# Altium schematic sheet CODEC.SchDoc
size A4; SheetNumber: 2; SheetTotal: 5
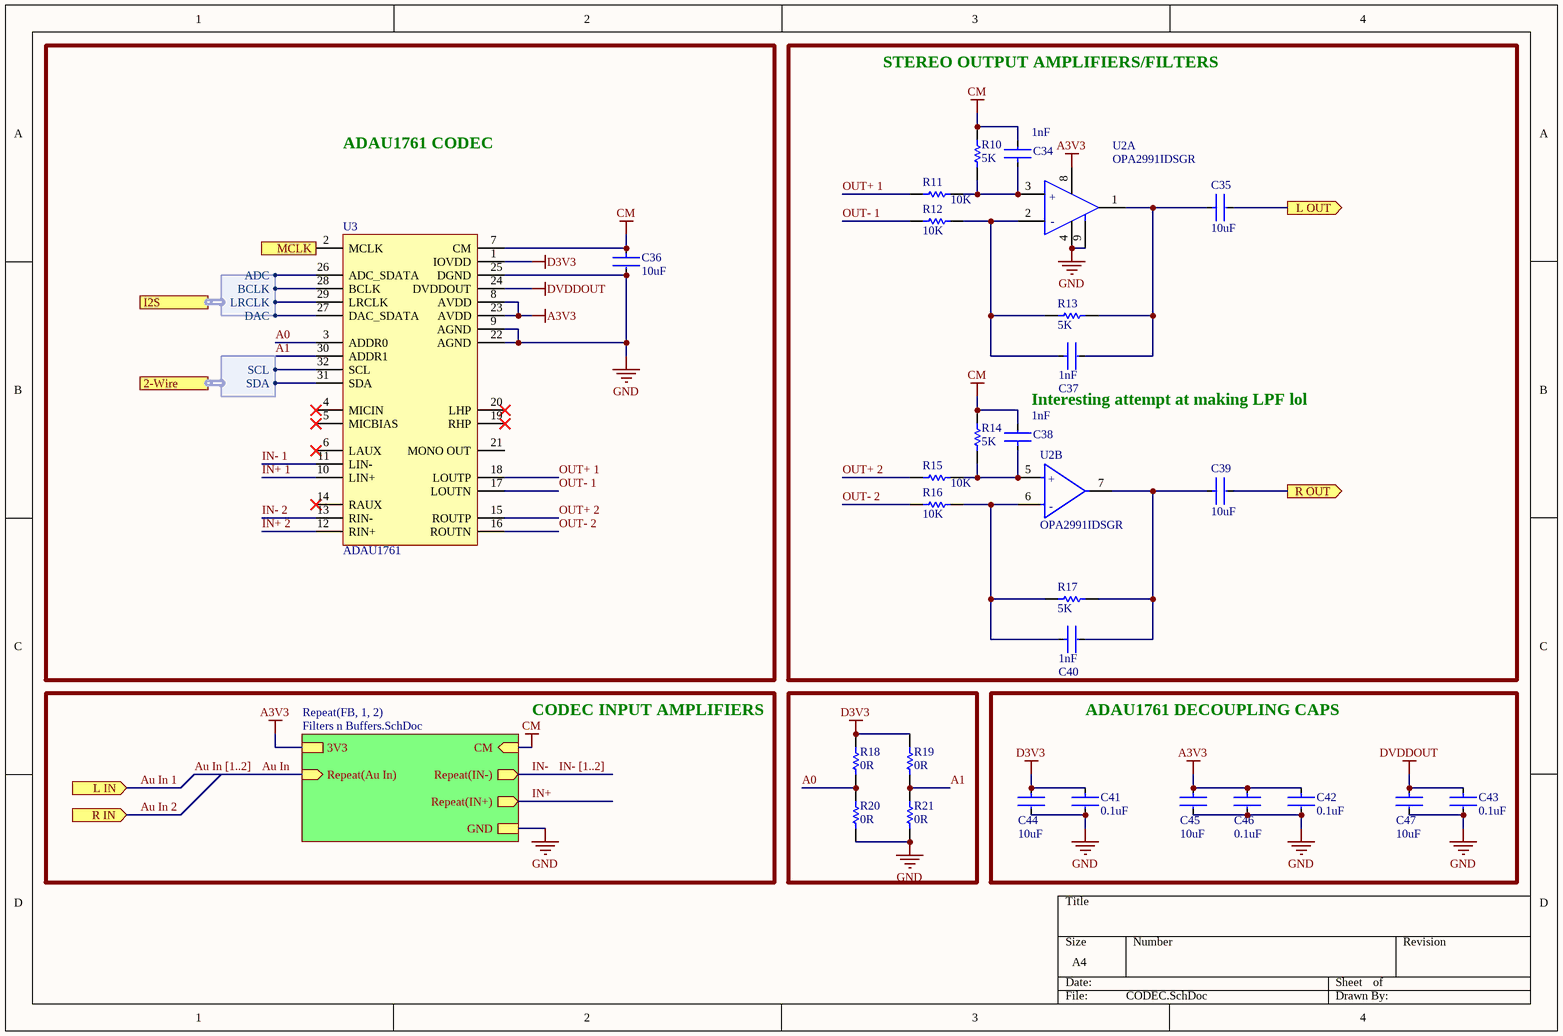
[diagram p0: CODEC.SchDoc]

## Parts
C34  1nF  [FP-GRM15-MFG]
C35  10uF  [FP-GRM15-MFG]
C36  10uF  [FP-GRM15-MFG]
C37  1nF  [FP-GRM15-MFG]
C38  1nF  [FP-GRM15-MFG]
C39  10uF  [FP-GRM15-MFG]
C40  1nF  [FP-GRM15-MFG]
C41  0.1uF  [FP-GRM15-MFG]
C42  0.1uF  [FP-GRM15-MFG]
C43  0.1uF  [FP-GRM15-MFG]
C44  10uF  [FP-GRM15-MFG]
C45  10uF  [FP-GRM15-MFG]
C46  0.1uF  [FP-GRM15-MFG]
C47  10uF  [FP-GRM15-MFG]
R10  5K  [RESC1005X40X25LL05T05]
R11  10K  [RESC1005X40X25LL05T05]
R12  10K  [RESC1005X40X25LL05T05]
R13  5K  [RESC1005X40X25LL05T05]
R14  5K  [RESC1005X40X25LL05T05]
R15  10K  [RESC1005X40X25LL05T05]
R16  10K  [RESC1005X40X25LL05T05]
R17  5K  [RESC1005X40X25LL05T05]
R18  0R  [RESC1005X40X25LL05T05]
R19  0R  [RESC1005X40X25LL05T05]
R20  0R  [RESC1005X40X25LL05T05]
R21  0R  [RESC1005X40X25LL05T05]
U2  OPA2991IDSGR  [FP-DSG0008A-MFG]  (parts A,B of 2)
U3  ADAU1761  [LFCSP-32]

## Blocks framed on the sheet
ADAU1761 CODEC: C36 U3
ADAU1761 DECOUPLING CAPS: C41-C47

## Sub-sheets
Repeat(FB, 1, 2) = Filters n Buffers.SchDoc: Repeat(IN-) (out), CM (in), Repeat(IN+) (out), Repeat(Au In) (in), 3V3, GND

## Ports
2-Wire (harness Two Wire), I2S (harness I2S), L IN (in), L OUT (out), MCLK (in), R IN (in), R OUT (out)

## Harnesses
Two Wire: SCL, SDA
I2S: ADC, BCLK, LRCLK, DAC

## Nets
A3V3: C42.2 C45.2 C46.2 U2.8(V+) U3.8(AVDD) U3.23(AVDD) ; sheet Repeat(FB, 1, 2)/3V3
CM: C34.1 C36.2 C38.1 R10.1 R14.1 U3.7(CM) ; sheet Repeat(FB, 1, 2)/CM
D3V3: C41.2 C44.2 R18.2 R19.2 U3.1(IOVDD)
DVDDOUT: C43.2 C47.2 U3.24(DVDDOUT)
GND: C36.1 C41.1 C42.1 C43.1 C44.1 C45.1 C46.1 C47.1 R20.1 R21.1 U2.4(V-) U2.9(Thermal_Pad) U3.9(AGND) U3.22(AGND) U3.25(DGND) ; sheet Repeat(FB, 1, 2)/GND
A0: R18.1 R20.2 U3.3(ADDR0)
A1: R19.1 R21.2 U3.30(ADDR1)
Au In: sheet Repeat(FB, 1, 2)/Repeat(Au In)
Au In 1: port L IN
Au In 2: port R IN
IN+: sheet Repeat(FB, 1, 2)/Repeat(IN+)
IN+ 1: U3.10(LIN+)
IN+ 2: U3.12(RIN+)
IN-: sheet Repeat(FB, 1, 2)/Repeat(IN-)  [also labelled IN- [1..2]]
IN- 1: U3.11(LIN-)
IN- 2: U3.13(RIN-)
L OUT: C35.1 ; port L OUT
MCLK: U3.2(MCLK) ; port MCLK
OUT+ 1: R11.2 U3.18(LOUTP)
OUT+ 2: R15.2 U3.15(ROUTP)
OUT- 1: R12.2 U3.17(LOUTN)
OUT- 2: R16.2 U3.16(ROUTN)
R OUT: C39.1 ; port R OUT
NetC34_2: C34.2 R10.2 R11.1 U2.3(IN1+)
NetC35_2: C35.2 C37.1 R13.2 U2.1(OUT1)
NetC37_2: C37.2 R12.1 R13.1 U2.2(IN1-)
NetC38_2: C38.2 R14.2 R15.1 U2.5(IN2+)
NetC39_2: C39.2 C40.1 R17.2 U2.7(OUT2)
NetC40_2: C40.2 R16.1 R17.1 U2.6(IN2-)
NetU3_26: U3.26(ADC_SDATA) ; port I2S.ADC
NetU3_27: U3.27(DAC_SDATA) ; port I2S.DAC
NetU3_28: U3.28(BCLK) ; port I2S.BCLK
NetU3_29: U3.29(LRCLK) ; port I2S.LRCLK
NetU3_31: U3.31(SDA) ; port 2-Wire.SDA
NetU3_32: U3.32(SCL) ; port 2-Wire.SCL

Not connected (* = marked no-connect by the designer): U3 4(MICIN)* 5(MICBIAS)* 6(LAUX)* 14(RAUX)* 19(RHP)* 20(LHP)* 21(MONO_OUT)

## Buses and harness runs
bus Au In [1..2]

## Notes on the sheet
- STEREO OUTPUT AMPLIFIERS/FILTERS
- Interesting attempt at making LPF lol
- CODEC INPUT AMPLIFIERS
- (in symbol CMP-04895-000388-1, part A) +; -
- (in symbol CMP-04895-000388-1, part B) +; -

## Library data of the parts
C34-C47 = CMP-2100-03641-2: CAP CER 0.1UF 16V X7R 0402; Manufacturer Part Number: GRM155R71C104KA88D; Manufacturer: Murata; Standoff Height: 0mm; Tolerance: 10%; Description: CAP Ceramic 0.10μF 10% X7R 16Vdc 0402 SMD; Voltage Rating: 16Vdc; Material: Ceramic; Capacitance: 0.10μF; Value: 0.10μF; RoHS: TRUE; Temperature Characteristic: X7R; Octopart: https://octopart.com/grm155r71c104ka88d-murata-196880; Digikey Description: CAP CER 0.1UF 16V X7R 0402; Device Class L3: Ceramic Capacitors; Height: 0.55mm; ComponentLink2Description: Datasheet; Temperature Range Low: -55°C; Ipc Land Pattern Name: CAPC10050X219; ComponentLink2URL: https://search.murata.co.jp/Ceramy/image/img/A01X/G101/ENG/GRM155R71H471KA01-01A.pdf; Device Class L1: Passive Components; Lead Free: yes; Category: Cap; Package: GRM15; Temperature: -55°C to +125°C; Device Class L2: Capacitors; Temperature Range High: +125°C; Mouser Description: 0402 0.1 uF 16V ±10 % Tolerance X7R SMT Multilayer Ceramic Capacitor
R10-R21 = CMP-2000-07451-1: Chip Resistor, 0 Ohm, 0.1 W, -55 to 155 degC, 0402 (1005 Metric), RoHS, Tape and Reel; Manufacturer: Panasonic; Voltage Rating (DC): 50V; Temperature Coefficient: 600ppm/��C; Max Power Dissipation: 100mW; Resistance: 0mOhm; Tolerance: 5%; Number of Terminations: 2; Mount: SurfaceMount; Height: 0.35mm; Packaging: TapeandReel; Contact Plating: Tin; Manufacturer URL: http://www.panasonic.com/; Composition: ThickFilm; Max Operating Temperature: 155degC; REACH SVHC: NoSVHC; Case/Package: 0402; Package Reference: 402; Depth: 0.5mm; Package Description: 2-Pin Surface Mount Device, Body 1 x 0.5 mm; Datasheet URL: https://industrial.panasonic.com/cdbs/www-data/pdf/RDA0000/AOA0000C301.pdf; RoHSCompliant: True; Case Code (Imperial): 0402; Military Standard: Not; Min Operating Temperature: -55degC; Power Rating: 100mW; Datasheet Version: 03/2015; Length: 1mm; Case Code (Metric): 1005; Termination: SMD/SMT; Mounting Technology: SurfaceMount; Voltage Rating: 50V; Width: 0.02inch; Package Quantity: 1; Lead Free: LeadFree; Radiation Hardening: No
U2 = CMP-04895-000388-1: IC OPAMP GP 2 CIRCUIT; RoHS Compliant: Yes
U3 = ADAU1761: Interface - CODECs Low Power Codec w/Sigma DSP